# EAGLE design OperantFEDv2 (EAGLE 7.7.0)
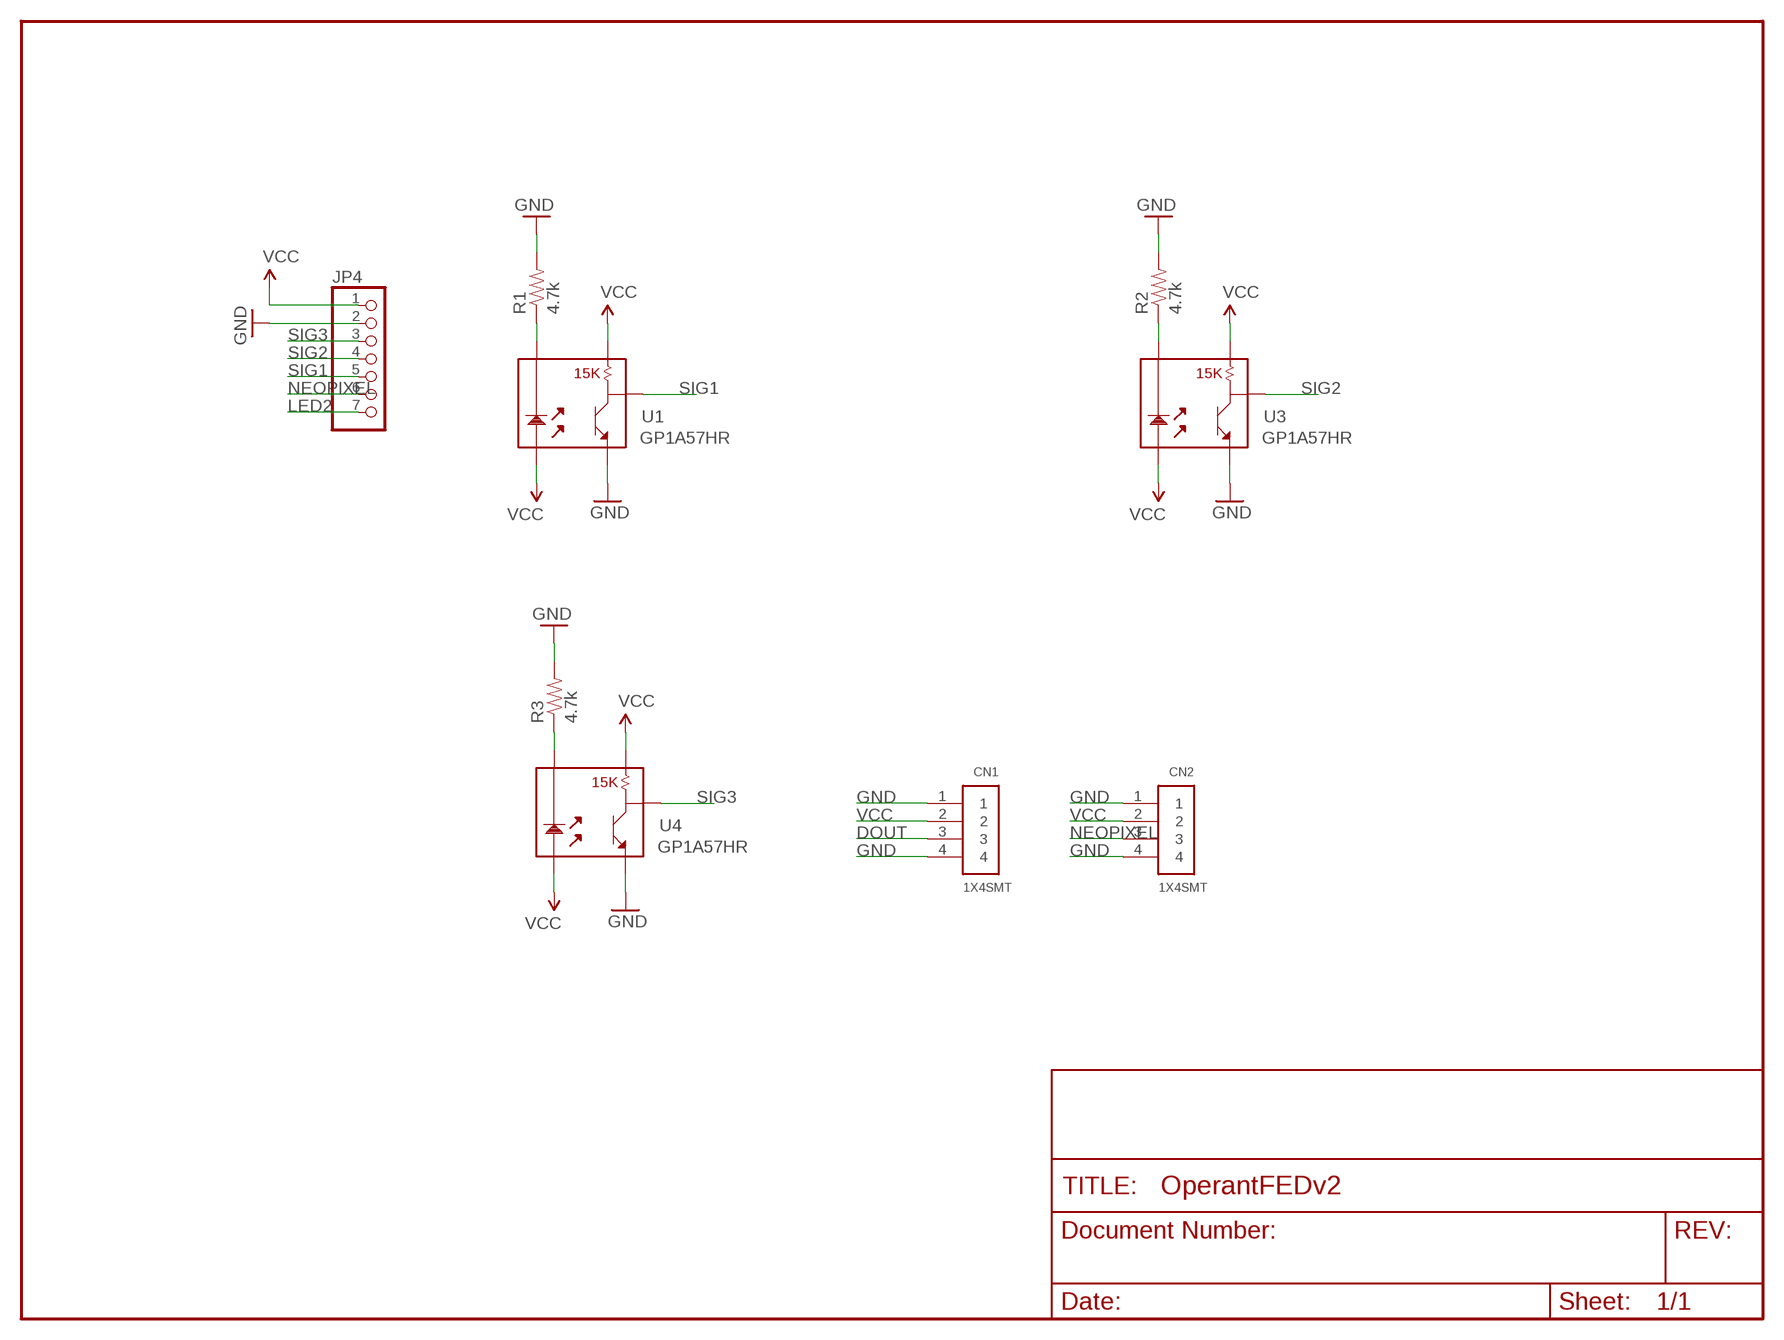
[diagram p0: schematic, sheet 1]

## Parts
CN1  1X4SMT  [1X4-SMT]
CN2  1X4SMT  [1X4-SMT]
JP4  PINHD-1X7  [1X07]
R1  4.7k  RESISTORPTH1  [AXIAL-0.3]
R2  4.7k  RESISTORPTH1  [AXIAL-0.3]
R3  4.7k  RESISTORPTH1  [AXIAL-0.3]
U1  GP1A57HR  [GP1A57HR]
U3  GP1A57HR  [GP1A57HR]
U4  GP1A57HR  [GP1A57HR]

## Nets
DOUT: CN1.3
GND: CN1.1 CN1.4 CN2.1 CN2.4 JP4.2 R1.P$2 R2.P$2 R3.P$2 U1.5 U3.5 U4.5
LED2: JP4.7
N$1: R2.P$1 U3.2
N$2: R1.P$1 U1.2
N$3: R3.P$1 U4.2
NEOPIXEL: CN2.3 JP4.6
SIG1: JP4.5 U1.4
SIG2: JP4.4 U3.4
SIG3: JP4.3 U4.4
VCC: CN1.2 CN2.2 JP4.1 U1.1 U1.3 U3.1 U3.3 U4.1 U4.3

## Library data of the parts
CN1 CN2 = adafruit:1X4: 4-pin connector
JP4 = pinhead:PINHD-1X7: PIN HEADER
R1-R3 = SparkFun:RESISTOR: Resistor Basic schematic elements and footprints for 0603, 1206, and PTH 1/10th watt (small) resistors.
U1 U3 U4 = SparkFun:GP1A57HR

## Board
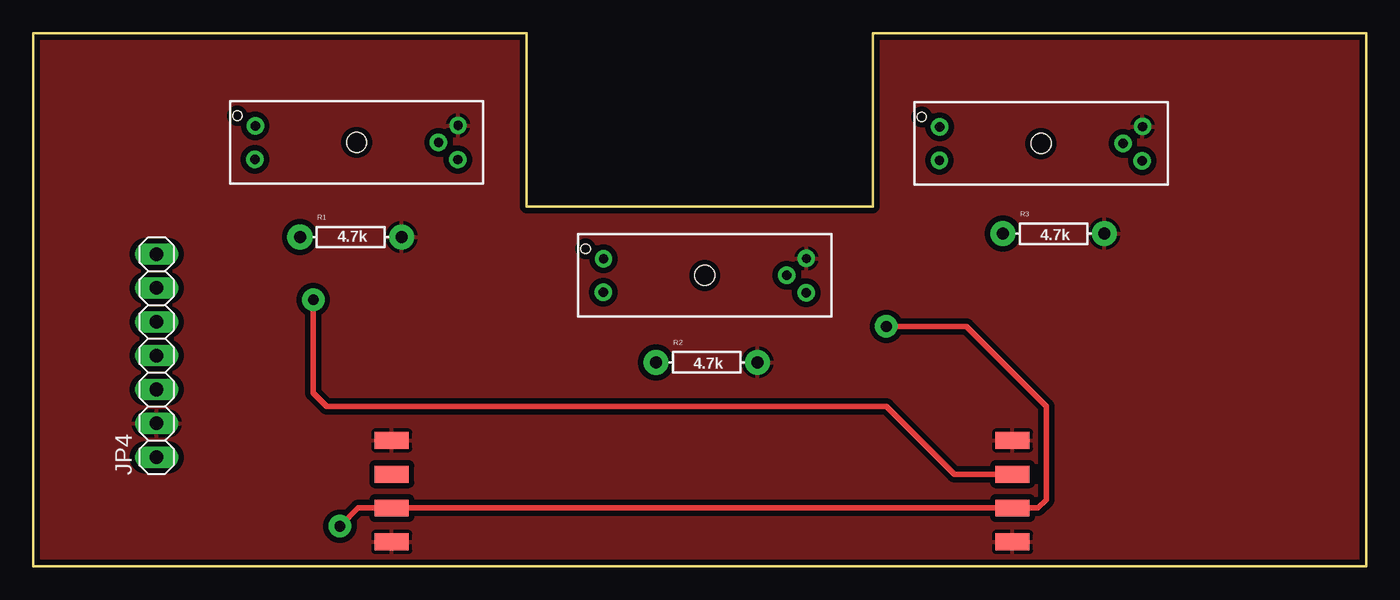
[diagram p1: board, top side]
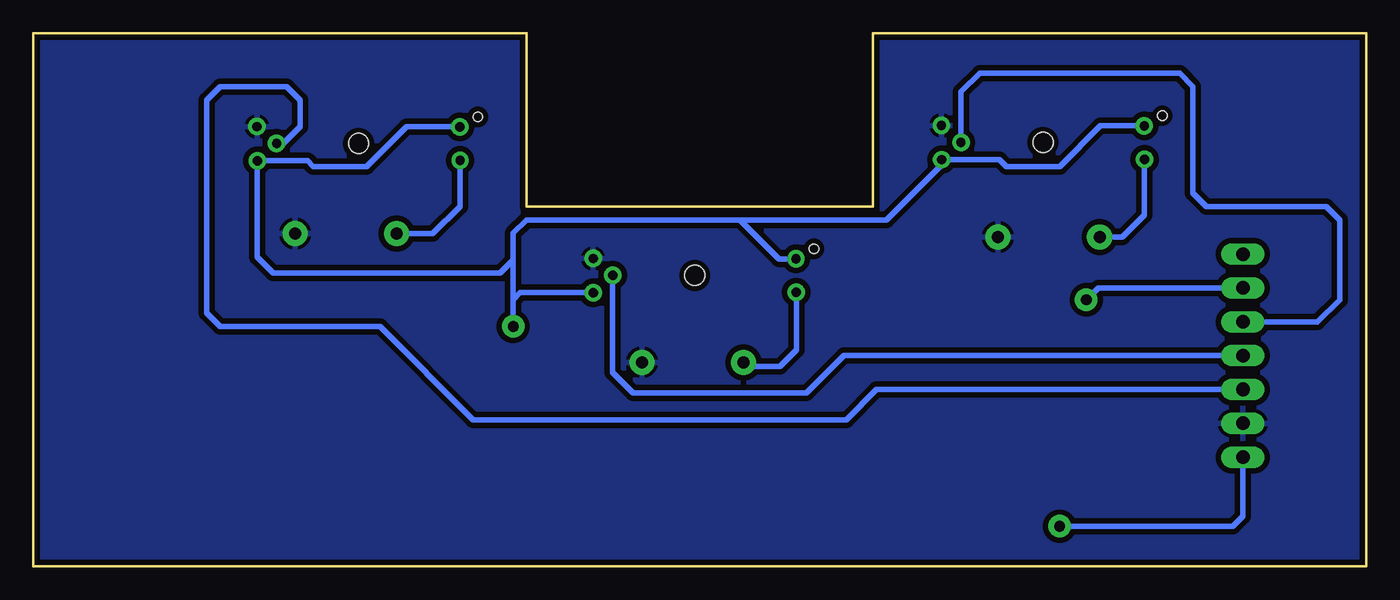
[diagram p2: board, bottom side, seen from below]

Size 100 x 40 mm. Coordinates in mm from the lower left corner, seen from the top.
Outline: 0,0 100,0 100,40 63,40 63,27 37,27 37,40 0,40 0,0
Copper layers (1*16): Top 0.0356mm / dielectric 1.5011mm / Bottom 0.0356mm
Design rules "default": minimum track width 8mil, minimum drill 20mil, track to track 8mil, track to pad 8mil, pad to pad 8mil, via to via 8mil, smd to smd 8mil, copper to edge 10mil, drill to drill 8mil, minimum pad ring 12mil, minimum via ring 10mil, stop-mask expansion 4mil, vias tented up to drill 20mil, thermal gap 10mil

### Footprints (pad centres in the part's own frame; a part is rotated, then mirrored left to right if it is on the bottom)
1X4-SMT = smd 1.27 x 2.54: 1 -3.81,0; 2 -1.27,0; 3 1.27,0; 4 3.81,0
1X07 = drill 1.016 long: 1 -7.62,0; 2 -5.08,0; 3 -2.54,0; 4 0,0; 5 2.54,0; 6 5.08,0; 7 7.62,0
AXIAL-0.3 = drill 0.9 pad 1.88: P$1 -3.81,0; P$2 3.81,0
GP1A57HR = drill 0.7: 1 -7.6,1.24; 2 -7.62,-1.27; 3 7.6,-1.3; 4 6.15,0; 5 7.62,1.27 | hole 1.5: 0,0 | hole 0.7: -8.95,2

### Placement (x,y rotation side)
CN1  26.89,5.63 90 top
CN2  73.46,5.63 90 top
JP4  9.25,15.81 90 top
R1  23.81,24.71 0 top
R2  50.53,15.31 0 top
R3  76.55,24.96 0 top
U1  24.25,31.82 0 top
U3  50.38,21.83 0 top
U4  75.6,31.73 0 top

### Tracks (layer width: path | path; a pad name or v marks a point on that pad's centre or on a via)
GND
  pour Top (isolate 0.406): -3,-2.93 101.74,-2.93 101.74,66.1 -3,66.1
  pour Bottom (isolate 0.406): -4.97,66.97 -4.97,-5.05 103.44,-4.95 103.44,67.07
N$1
  Bottom 0.406: U3.2 42.76,16.24 44,15 46.41,15 R2.P$1
N$2
  Bottom 0.406: U1.2 16.63,26.37 18.29,24.71 R1.P$1
N$3
  Bottom 0.406: R3.P$1 70.04,24.96 68,27 68,30.44 U4.2
NEOPIXEL  (via drill 0.8 pad 1.68)
  Top 0.406: CN2.3 69.09,6.91 64,12 22,12 21,13 v21,20
  Bottom 0.406: JP4.6 20.11,20.89 v21,20
SIG1
  Bottom 0.406: U1.4 30.4,35.6 29,37 14,37 13,36 13,28 12,27 3,27 2,26 2,20 3.65,18.35 JP4.5
SIG2
  Bottom 0.406: JP4.4 39.19,15.81 42,13 55,13 56.53,14.53 U3.4
SIG3
  Bottom 0.406: U4.4 81.27,31.73 80,33 80,35 81,36 86,36 87,35 87,19 86,18 74,18 67,11 39,11 36.73,13.27 JP4.3
VCC  (via drill 0.8 pad 1.68)
  Top 0.406: v23,3 24.36,4.37 CN1.2 CN2.2 75.36,4.37 76,5 76,12 70,18 v64,18
  Bottom 0.406: U4.1 68.03,33 72,33 75,30 79,30 79.43,30.43 U4.3 83.2,23.2 82,22 65,22 64,23 | U1.1 19.94,33.06 23,30 27,30 27.52,30.52 U1.3 31.85,30.15 36,26 47,26 | v23,3 10,3 9.25,3.75 JP4.1 | U3.1 44.07,23.07 47,26 | 47,26 63,26 64,25 64,23 | 64,23 64,20 | 64,20 v64,18 | U3.3 63.47,20.53 64,20